# Altium schematic sheet Power_management.SchDoc
size A
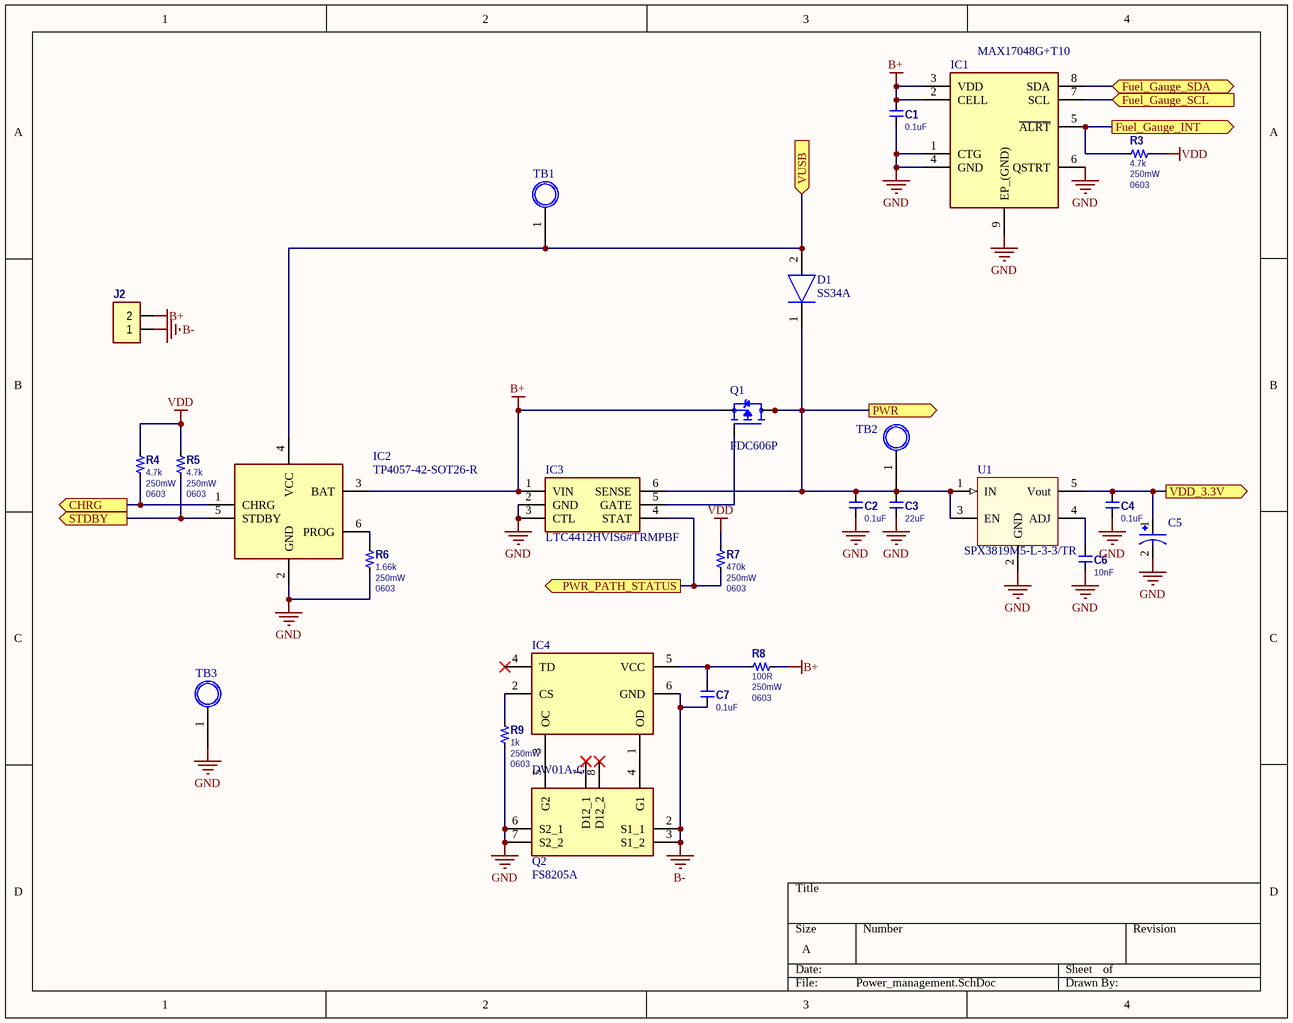
[diagram p0: Power_management.SchDoc]

## Parts
C1  0.1uF  [0603-C]
C2  0.1uF  [0603-C]
C3  22uF  [0603-C]
C4  0.1uF  [0603-C]
C5  T493X227K010BH6420_220uF  [CAPPM7343X430N]  (value not drawn)
C6  10nF  [0603-C]
C7  0.1uF  [0603-C]
D1  SS34A  [DIOM5026X262N]
IC1  MAX17048G+T10  [SON50P200X200X80-9N-D]
IC2  TP4057-42-SOT26-R  [SOT95P280X125-6N]
IC3  LTC4412HVIS6#TRMPBF  [SOT95P280X100-6N]
IC4  DW01A-G  [SOT95P280X135-6N]
J2  455-2247-ND  [CON_HDR1x2]  (value not drawn)
Q1  FDC606P  [SUPERSOT-6]
Q2  FS8205A  [SOP65P640X120-8N]
R3  4.7k  Power Rating: 250mW  Case/Package: 0603  [0603-R]
R4  4.7k  Power Rating: 250mW  Case/Package: 0603  [0603-R]
R5  4.7k  Power Rating: 250mW  Case/Package: 0603  [0603-R]
R6  1.66k  Power Rating: 250mW  Case/Package: 0603  [0603-R]
R7  470k  Power Rating: 250mW  Case/Package: 0603  [0603-R]
R8  100R  Power Rating: 250mW  Case/Package: 0603  [0603-R]
R9  1k  Power Rating: 250mW  Case/Package: 0603  [0603-R]
TB1  Test_Pad  [Test_Pad]  (value not drawn)
TB2  Test_Pad  [Test_Pad]  (value not drawn)
TB3  Test_Pad  [Test_Pad]  (value not drawn)
U1  SPX3819M5-L-3-3/TR  [SOT23-5]

## Ports
CHRG (out), Fuel_Gauge_INT (out), Fuel_Gauge_SCL (in), Fuel_Gauge_SDA (bidir), PWR (out), PWR_PATH_STATUS (out), STDBY (out), VDD_3.3V (out), VUSB (in)

## Nets
B+: C1.1 IC1.2(CELL) IC1.3(VDD) IC2.3(BAT) IC3.1(VIN) J2.2 Q1.4(S) R8.2
B-: C7.2 IC4.6(GND) J2.1 Q2.2(S1_1) Q2.3(S1_2)
GND: C1.2 C2.2 C3.2 C4.2 C5.2 C6.2 IC1.1(CTG) IC1.4(GND) IC1.6(QSTRT) IC1.9(EP_(GND)) IC2.2(GND) IC3.2(GND) IC3.3(CTL) Q2.6(S2_1) Q2.7(S2_2) R6.2 R9.2 TB3.1 U1.2(GND)
VDD: R3.2 R4.1 R5.1 R7.2
CHRG: IC2.1(CHRG) R4.2 ; port CHRG
Fuel_Gauge_INT: IC1.5(~{ALRT}) R3.1 ; port Fuel_Gauge_INT
Fuel_Gauge_SCL: IC1.7(SCL) ; port Fuel_Gauge_SCL
Fuel_Gauge_SDA: IC1.8(SDA) ; port Fuel_Gauge_SDA
PWR: C2.1 C3.1 D1.1(K) IC3.6(SENSE) Q1.1(D) Q1.2(D) Q1.5(D) Q1.6(D) TB2.1 U1.1(IN) U1.3(EN) ; port PWR
PWR_PATH_STATUS: IC3.4(STAT) R7.1 ; port PWR_PATH_STATUS
STDBY: IC2.5(STDBY) R5.2 ; port STDBY
VDD_3.3V: C4.1 C5.1 U1.5(Vout) ; port VDD_3.3V
VUSB: D1.2(A) IC2.4(VCC) TB1.1 ; port VUSB
NetC6_1: C6.1 U1.4(ADJ)
NetC7_1: C7.1 IC4.5(VCC) R8.1
NetIC2_6: IC2.6(PROG) R6.1
NetIC3_5: IC3.5(GATE) Q1.3(G)
NetIC4_1: IC4.1(OD) Q2.4(G1)
NetIC4_2: IC4.2(CS) R9.1
NetIC4_3: IC4.3(OC) Q2.5(G2)

Not connected (* = marked no-connect by the designer): IC4 4(TD)*; Q2 1(D12_1)* 8(D12_2)*

## Library data of the parts
C1-C4 C6 C7 = CAP: Manufacturer: TDK EPCOS; Manufacturer Part Number: B37941K9105K62; Capacitance: 1uF; Voltage Rating: 16V; Tolerance: 10%; ComponentLink1URL: https://datasheet.ciiva.com/13389/upy-gphc-y5v-6-3v-to-50v-5-13389978.pdf?src-supplier=Mouser; ComponentLink1Description: Datasheet; Supplier 1: Digi-Key; RoHS: Yes; Category: Ceramic Capacitors; Mount: Surface Mount; Case/Package: 0805; Case Code (Metric): 2012; Case Code (Imperial): 0805; Min Operating Temperature: -55°C; Max Operating Temperature: 125°C; Package Quantity: 3000; Packaging: Tape and Reel; Voltage Rating (DC): 16V; Length: 0.079inch; Width: 0.049inch; Height: 1.35mm; Thickness: 0.049inch; Ratings: AEC-Q200; Lead Free: Lead Free; ComponentLink2URL: http://components.arrow.com/part/dataview/0323_01879911?src-supplier=Arrow+Europe; ComponentLink2Description: http://components.arrow.com/part/dataview/0323_01879911?src-supplier=Arrow+Europe; ComponentLink3URL: https://media.digikey.com/pdf/Data%20Sheets/Epcos%20PDFs/B37872K_B37941K_Series.pdf?src-supplier=Digi-Key; ComponentLink3Description: https://media.digikey.com/pdf/Data%20Sheets/Epcos%20PDFs/B37872K_B37941K_Series.pdf?src-supplier=Digi-Key; Supplier Part Number 1: 495-1935-1-ND
C5 = T493X227K010BH6420_220uF: MF: Kemet; Value: *; MP: T493X227K010BH6420; Package: SMD-2 Kemet; Availability: In Stock; Check_prices: https://www.snapeda.com/parts/T493X227K010BH6420/Kemet/view-part/?ref=eda; SnapEDA_Link: https://www.snapeda.com/parts/T493X227K010BH6420/Kemet/view-part/?ref=snap; Price: None
D1 = SS34A: Diode; Manufacturer_Name: HY Electronic Corp; Datasheet Link: https://datasheet.datasheetarchive.com/originals/distributors/Datasheets-3/DSA-43252.pdf; Height: 2.62mm; Manufacturer_Part_Number: SS34A
IC1 = MAX17048G+T10: Integrated Circuit; Manufacturer_Name: Maxim Integrated; Datasheet Link: https://datasheets.maximintegrated.com/en/ds/MAX17048-MAX17049.pdf; Height: 0.8mm; Manufacturer_Part_Number: MAX17048G+T10; Mouser Part Number: 700-MAX17048G+T10; Mouser Price/Stock: https://www.mouser.co.uk/ProductDetail/Maxim-Integrated/MAX17048G%2bT10?qs=D7PJwyCwLAoGnnn8jEPRBQ%3D%3D; Arrow Part Number: MAX17048G+T10; Arrow Price/Stock: https://www.arrow.com/en/products/max17048gt10/maxim-integrated?region=nac
IC2 = TP4057-42-SOT26-R: Integrated Circuit; Manufacturer_Name: Nanjing Extension Microelectronics; Datasheet Link: https://datasheet.lcsc.com/szlcsc/Nanjing-Extension-Microelectronics-TP4057_C12044.pdf; Height: 1.25mm; Manufacturer_Part_Number: TP4057-42-SOT26-R
IC3 = LTC4412HVIS6#TRMPBF: Integrated Circuit; Manufacturer_Name: Linear Technology; Datasheet Link: https://datasheet.datasheetarchive.com/originals/dk/DKDS-14/267243.pdf; Height: 1mm; Manufacturer_Part_Number: LTC4412HVIS6#TRMPBF; Mouser Part Number: 584-C4412HVIS6TRMPBF; Mouser Price/Stock: https://www.mouser.co.uk/ProductDetail/Analog-Devices-Linear-Technology/LTC4412HVIS6TRMPBF?qs=hVkxg5c3xu%2F0qD9zc%2Fd4vw%3D%3D; Arrow Part Number: LTC4412HVIS6#TRMPBF; Arrow Price/Stock: https://www.arrow.com/en/products/ltc4412hvis6trmpbf/linear-technology
IC4 = DW01A-G: Integrated Circuit; Manufacturer_Name: Fortune Semiconductor Corporation; Datasheet Link: http://acoptex.com/uploads/DW01A.pdf; Height: 1.35mm; Manufacturer_Part_Number: DW01A-G
J2 = CON_HDR1x2: ComponentLink1URL: https://www.jst-mfg.com/product/pdf/eng/eXH.pdf; ComponentLink1Description: Datasheet
Q1 = FDC606P: P-Channel 12V 6A (Ta) 1.6W (Ta) Surface Mount SuperSOTâ„¢-6; MF: ON Semiconductor; Price: None; Purchase-URL: https://pricing.snapeda.com/search/part/FDC606P/?ref=eda; Value: *; Availability: Good; Check_prices: https://www.snapeda.com/parts/FDC606P/ON%20Semiconductor/view-part/2501971/?ref=eda; SnapEDA_Link: https://www.snapeda.com/parts/FDC606P/ON%20Semiconductor/view-part/2501971/?ref=snap; MP: FDC606P; Package: TSOT-23-6 ON Semiconductor
Q2 = FS8205A: Transistor; Manufacturer_Name: SII Semiconductor; Datasheet Link: http://www.ic-fortune.com/upload/Download/FS8205A-DS-12_EN.pdf; Height: 1.2mm; Manufacturer_Part_Number: FS8205A
R3-R9 = Res: Manufacturer: Panasonic; Manufacturer Part Number: ERJ-8GEYJ621V; Resistance: 620R; Tolerance: 5%; Voltage Rating: 200V; Temperature Coefficient: 200ppm/°C; ComponentLink1URL: https://datasheet.ciiva.com/15193/getdatasheetpartid-366470-15193725.pdf?src-supplier=Verical; ComponentLink1Description: Datasheet; Supplier 1: Avnet; Stock 1: 6255; Pricing 1: 1 = 0.01200 (USD); RoHS: Yes; Mount: Surface Mount; Case Code (Metric): 3216; Case Code (Imperial): 1206; Contact Plating: Tin; Min Operating Temperature: -55°C; Max Operating Temperature: 155°C; Packaging: Tape and Reel; Package Quantity: 1; Resistor Type: Thick Film; Number of Terminations: 2; Max Power Dissipation: 250mW; Voltage Rating (DC): 200V; Features: Automotive AEC-Q200; Series: ERJ; Construction: Rectangular; Resistance Tolerance: 5%; Length: 3.2mm; Width: 0.063inch; Height: 0.028inch; Depth: 1.6mm; Radiation Hardening: No; REACH SVHC: No SVHC; Military Standard: Not; Lead Free: Lead Free; RoHS Compliant: Yes; ComponentLink2URL: https://datasheet.ciiva.com/46387/1500035-46387094.pdf?src-supplier=Element14; ComponentLink2Description: https://datasheet.ciiva.com/46387/1500035-46387094.pdf?src-supplier=Element14; ComponentLink3URL: https://datasheet.ciiva.com/5915/1500035-5915369.pdf?src-supplier=Farnell; ComponentLink3Description: https://datasheet.ciiva.com/5915/1500035-5915369.pdf?src-supplier=Farnell; ComponentLink4URL: https://datasheet.ciiva.com/28677/1678796-28677018.pdf?src-supplier=Element14; ComponentLink4Description: https://datasheet.ciiva.com/28677/1678796-28677018.pdf?src-supplier=Element14; ComponentLink5URL: https://datasheet.ciiva.com/17204/aoa0000ce1-17204972.pdf?src-supplier=Avnet+Europe; ComponentLink5Description: https://datasheet.ciiva.com/17204/aoa0000ce1-17204972.pdf?src-supplier=Avnet+Europe; ComponentLink6URL: https://datasheet.ciiva.com/16515/aoa0000ce1-16515933.pdf?src-supplier=Avnet+Asia; ComponentLink6Description: https://datasheet.ciiva.com/16515/aoa0000ce1-16515933.pdf?src-supplier=Avnet+Asia; Supplier Part Number 1: 65T8955
U1 = SPX3819: Linear Voltage Regulator IC 1 Output 500mA SOT-23-5; MF: MaxLinear, Inc.; SnapEDA_Link: https://www.snapeda.com/parts/SPX3819/MaxLinear,%20Inc./view-part/885098/?ref=snap; Package: SOT-23-5 MaxLinear, Inc.; Availability: Unavailable; Price: None; MP: SPX3819; Value: *